# Altium schematic sheet Pedal_Prueba.SchDoc
size A4
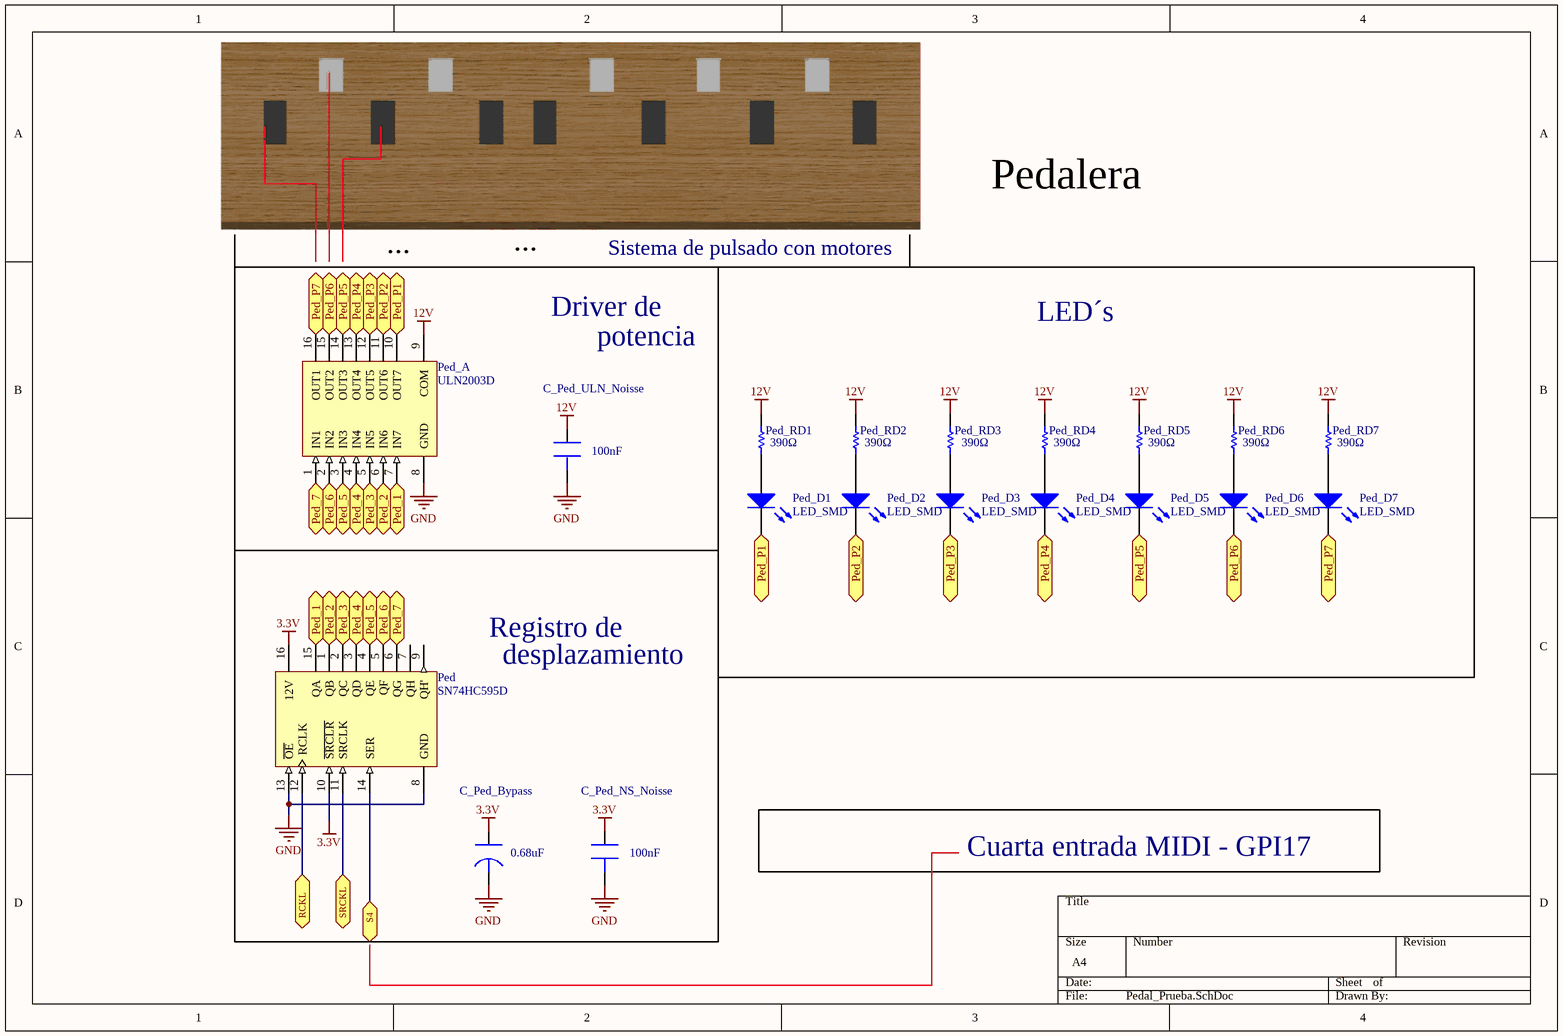
[diagram p0: Pedal_Prueba.SchDoc]

## Parts
C_Ped_Bypass  value 0.68uF  [Panasonic B Size]  (hidden comment: Panasonic 1uF)
C_Ped_NS_Noisse  value 100nF  [AVX Carcasa 1.206]  (hidden comment: AVX 100nF)
C_Ped_ULN_Noisse  value 100nF  [AVX Carcasa 1.206]  (hidden comment: AVX 100nF)
Ped  SN74HC595D  [SN74HC595D]
Ped_A  ULN2003D  [ULN2003AI]
Ped_D1  LED_SMD  [LED_0805]
Ped_D2  LED_SMD  [LED_0805]
Ped_D3  LED_SMD  [LED_0805]
Ped_D4  LED_SMD  [LED_0805]
Ped_D5  LED_SMD  [LED_0805]
Ped_D6  LED_SMD  [LED_0805]
Ped_D7  LED_SMD  [LED_0805]
Ped_RD1  value 390Ω  [Resistencia_0805_N]  (hidden comment: Res Chip 0805)
Ped_RD2  value 390Ω  [Resistencia_0805_N]  (hidden comment: Res Chip 0805)
Ped_RD3  value 390Ω  [Resistencia_0805_N]  (hidden comment: Res Chip 0805)
Ped_RD4  value 390Ω  [Resistencia_0805_N]  (hidden comment: Res Chip 0805)
Ped_RD5  value 390Ω  [Resistencia_0805_N]  (hidden comment: Res Chip 0805)
Ped_RD6  value 390Ω  [Resistencia_0805_N]  (hidden comment: Res Chip 0805)
Ped_RD7  value 390Ω  [Resistencia_0805_N]  (hidden comment: Res Chip 0805)

## Ports
Ped_1, Ped_2, Ped_3, Ped_4, Ped_5, Ped_6, Ped_7, Ped_P1, Ped_P2, Ped_P3, Ped_P4, Ped_P5, Ped_P6, Ped_P7, RCKL, S4, SRCKL

## Nets
3.3V: C_Ped_Bypass.1 C_Ped_NS_Noisse.1 Ped.10(~{SRCLR}) Ped.16(12V)
12V: C_Ped_ULN_Noisse.1 Ped_A.9(COM) Ped_RD1.2 Ped_RD2.2 Ped_RD3.2 Ped_RD4.2 Ped_RD5.2 Ped_RD6.2 Ped_RD7.2
GND: C_Ped_Bypass.2 C_Ped_NS_Noisse.2 C_Ped_ULN_Noisse.2 Ped.8(GND) Ped.13(~{OE}) Ped_A.8(GND)
Ped_1: Ped.15(QA) Ped_A.7(IN7) ; port Ped_1
Ped_2: Ped.1(QB) Ped_A.6(IN6) ; port Ped_2
Ped_3: Ped.2(QC) Ped_A.5(IN5) ; port Ped_3
Ped_4: Ped.3(QD) Ped_A.4(IN4) ; port Ped_4
Ped_5: Ped.4(QE) Ped_A.3(IN3) ; port Ped_5
Ped_6: Ped.5(QF) Ped_A.2(IN2) ; port Ped_6
Ped_7: Ped.6(QG) Ped_A.1(IN1) ; port Ped_7
Ped_P1: Ped_A.10(OUT7) Ped_D1.2(K) ; port Ped_P1
Ped_P2: Ped_A.11(OUT6) Ped_D2.2(K) ; port Ped_P2
Ped_P3: Ped_A.12(OUT5) Ped_D3.2(K) ; port Ped_P3
Ped_P4: Ped_A.13(OUT4) Ped_D4.2(K) ; port Ped_P4
Ped_P5: Ped_A.14(OUT3) Ped_D5.2(K) ; port Ped_P5
Ped_P6: Ped_A.15(OUT2) Ped_D6.2(K) ; port Ped_P6
Ped_P7: Ped_A.16(OUT1) Ped_D7.2(K) ; port Ped_P7
RCKL: Ped.12(RCLK) ; port RCKL
S4: Ped.14(SER) ; port S4
SRCKL: Ped.11(SRCLK) ; port SRCKL
NetPed_D1_1: Ped_D1.1(A) Ped_RD1.1
NetPed_D2_1: Ped_D2.1(A) Ped_RD2.1
NetPed_D3_1: Ped_D3.1(A) Ped_RD3.1
NetPed_D4_1: Ped_D4.1(A) Ped_RD4.1
NetPed_D5_1: Ped_D5.1(A) Ped_RD5.1
NetPed_D6_1: Ped_D6.1(A) Ped_RD6.1
NetPed_D7_1: Ped_D7.1(A) Ped_RD7.1

Not connected (* = marked no-connect by the designer): Ped 7(QH) 9(QH')

## Notes on the sheet
- Pedalera
- ...
- Sistema de pulsado con motores
- Driver de
- potencia
- LED´s
- Registro de
- desplazamiento
- Cuarta entrada MIDI - GPI17

## Library data of the parts
C_Ped_Bypass = Panasonic 1uF: Condensador Electrolítico SMD; Manufacturer #1: Nippon Chemi-Con; Part Number: EMV-500ADA101MJA0G; Tolerance: 20%; Ref. Mafero: 230; Voltage Rating: 50V; PCB DECAL: Panasonic B; Author: Jaime Jiménez Ortega; Cost: 0,718€; Date: 21/05/2009; Distributor: RS; Ref Distributor: 5479063
C_Ped_NS_Noisse C_Ped_ULN_Noisse = AVX 100nF: Condensador Cerámico SMD; Manufacturer #1: Nippon Chemi-Con; Part Number: EMV-500ADA101MJA0G; Tolerance: 20%; Ref. Mafero: 230; Voltage Rating: 50V; Author: Jaime Jiménez Ortega; Cost: 0,718€; Date: 21/05/2009; Distributor: RS; Ref Distributor: 5479063; PCB DECAL: AVX 1206
Ped = SN74HC595D: 8-Bit Shift Register with 3-State Output Registers; Published: 8-Jun-2000; LatestRevisionDate: 13-Apr-2006; LatestRevisionNote: IPC-7351 Footprint Added.; DatasheetVersion: May-1997; PackageVersion: Jan-1998; PackageReference: D016; Publisher: Altium Limited; PackageDescription: 16-Pin Small Outline Integrated Circuit 1.27 mm Pitch; Code_IPC: SOIC127P600-16; ComponentLink1Description: Manufacturer Link; ComponentLink1URL: http://www.ti.com/; ComponentLink2Description: Datasheet; ComponentLink2URL: http://www-s.ti.com/sc/ds/sn74hc595.pdf
Ped_A = ULN2003D: Seven Darlington Array; Published: 8-Jun-2000; LatestRevisionDate: 13-Apr-2006; LatestRevisionNote: IPC-7351 Footprint Added.; DatasheetVersion: Sep-1998; PackageVersion: May-1998; PackageReference: SO16; Publisher: Altium Limited; PackageDescription: 16-Pin Small Outline Integrated Circuit 1.27 mm Pitch; Code_IPC: SOIC127P600-16; ComponentLink1Description: Manufacturer Link; ComponentLink1URL: http://www.st.com/; ComponentLink2Description: Datasheet; ComponentLink2URL: http://www.st.com/stonline/products/literature/ds/5279/uln2001.pdf
Ped_D1-Ped_D7 = LED_SMD: LED SMD; Published: 8-Jun-2000; LatestRevisionDate: 08-Jul-2005; LatestRevisionNote: Mech Layer 1 removed.; PackageReference: LED-0; Publisher: Altium Limited
Ped_RD1-Ped_RD7 = Resistencia: Published: 8-Jun-2000; LatestRevisionDate: 17-Jul-2002; LatestRevisionNote: Re-released for DXP Platform.; PackageReference: AXIAL-0.3; Publisher: Altium Limited; PackageDescription: Axial Device, Thru-Hole; 2 Leads; 0.3 in Pin Spacing